# EAGLE design radiofmtx (EAGLE 4.16)
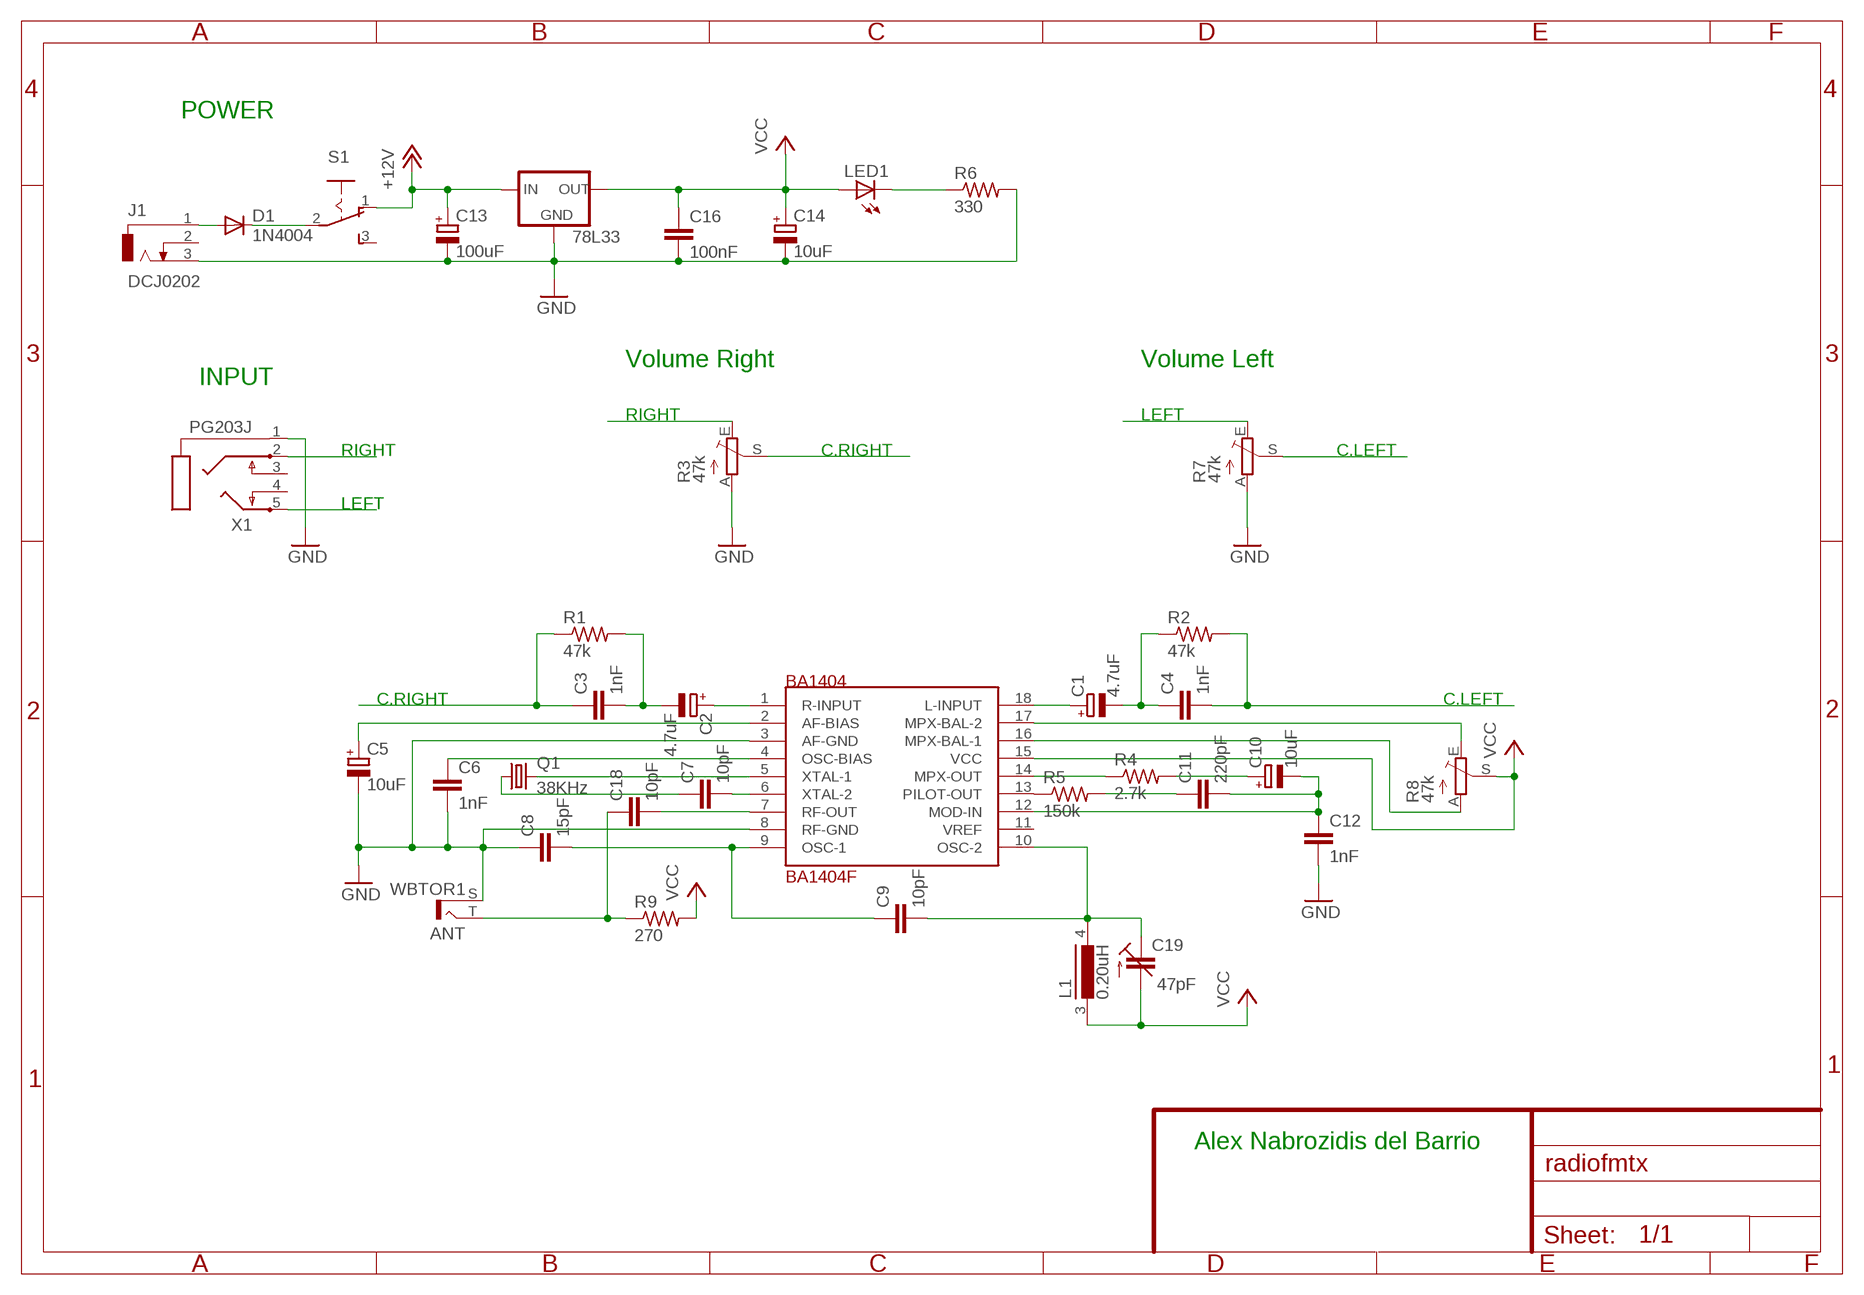
[diagram p0: schematic, sheet 1]

## Parts
78L33  78XXS  [78XXS]
ANT  WBTOR1  [WBTOR1]
BA1404  BA1404F  [BA1404F]
C1  4.7uF  CPOL-EUTAP5-50  [TAP5-50]
C2  4.7uF  CPOL-EUTAP5-50  [TAP5-50]
C3  1nF  C-EU050-025X075  [C050-025X075]
C4  1nF  C-EU050-025X075  [C050-025X075]
C5  10uF  CPOL-EUTAP5-50  [TAP5-50]
C6  1nF  C-EU050-025X075  [C050-025X075]
C7  10pF  C-EU050-024X044  [C050-024X044]
C8  15pF  C-EU050-024X044  [C050-024X044]
C9  10pF  C-EU050-024X044  [C050-024X044]
C10  10uF  CPOL-EUTAP5-50  [TAP5-50]
C11  220pF  C-EU050-024X044  [C050-024X044]
C12  1nF  C-EU050-025X075  [C050-025X075]
C13  100uF  CPOL-EUTAP5-50  [TAP5-50]
C14  10uF  CPOL-EUTAP5-45  [TAP5-45]
C16  100nF  C-EU050-025X075  [C050-025X075]
C18  10pF  C-EU050-024X044  [C050-024X044]
C19  47pF  C-TRIMM808  [CTRIM808-BC]
D1  1N4004  [DO41-10]
J1  DCJ0202  [DCJ0202]
L1  0.20uH  SK11  [SK11]
LED1  LED5MM  [LED5MM]
Q1  38KHz  CRYSTALTC26V  [TC26V]
R1  47k  R-US_0207/7  [0207/7]
R2  47k  R-US_0207/7  [0207/7]
R3  47k  TRIM_EU-S63S  [S63S]
R4  2.7k  R-US_0207/7  [0207/7]
R5  150k  R-US_0207/7  [0207/7]
R6  330  R-US_0207/7  [0207/7]
R7  47k  TRIM_EU-S63S  [S63S]
R8  47k  TRIM_EU-S63S  [S63S]
R9  270  R-US_0207/7  [0207/7]
S1  255SB  [255SB]
X1  PG203J  [PG203J]

## Nets
+12V: 78L33.IN C13.+ S1.1(O)
C.LEFT: C4.2 R2.2 R7.S
C.RIGHT: C3.1 R1.1 R3.S
GND: 78L33.GND ANT.S BA1404.3(AF-GND) BA1404.8(RF-GND) C5.- C6.2 C8.1 C12.2 C13.- C14.- C16.2 J1.3 R3.A R6.2 R7.A X1.1
LEFT: R7.E X1.5
N$1: BA1404.1(R-INPUT) C2.+
N$2: BA1404.18(L-INPUT) C1.+
N$3: C2.- C3.2 R1.2
N$4: C1.- C4.1 R2.1
N$5: BA1404.2(AF-BIAS) C5.+
N$6: C7.1 Q1.1
N$7: BA1404.4(OSC-BIAS) C6.1
N$8: BA1404.5(XTAL-1) Q1.2
N$9: BA1404.6(XTAL-2) C7.2
N$10: BA1404.9(OSC-1) C8.2 C9.1
N$11: BA1404.10(OSC-2) C9.2 C19.1(E) L1.4
N$12: BA1404.17(MPX-BAL-2) R8.E
N$13: BA1404.16(MPX-BAL-1) R8.A
N$14: BA1404.12(MOD-IN) C10.- C11.2 C12.1
N$15: LED1.K(C) R6.1
N$16: BA1404.14(MPX-OUT) R4.1
N$17: BA1404.13(PILOT-OUT) R5.1
N$18: C10.+ R4.2
N$19: C11.1 R5.2
N$22: D1.A J1.1
N$23: BA1404.7(RF-OUT) C18.2
N$24: ANT.T C18.1 R9.1
N$25: D1.C S1.2(P)
RIGHT: R3.E X1.2
VCC: 78L33.OUT BA1404.15(VCC) C14.+ C16.1 C19.2(A) L1.3 LED1.A R8.S R9.2
Unconnected: BA1404.11(VREF) J1.2 S1.3(S) X1.3 X1.4

## Notes on the sheet
- POWER
- Volume Right | Volume Left
- INPUT
- RIGHT | LEFT
- RIGHT | C.RIGHT | C.LEFT
- LEFT
- C.RIGHT | C.LEFT
- Alex Nabrozidis del Barrio

## Library data of the parts
78L33 = v-reg:78XXS: VOLTAGE REGULATOR
ANT = rca:WBTOR1: RCA connectors according to JEITA RC-5231 Cinch RCA-Einbaukupplung nach JEITA RC-5231, abgewinkelte Ausführung Source: http://www.lumberg.de/Produkte/PDFs/WBTOR1.pdf
BA1404 = ba1404:BA1404: BA1404 FM STEREO TRANSMITTER Based on the english datasheet.
C1 C2 C5 C10 C13 C14 = rcl:CPOL-EU: POLARIZED CAPACITOR, European symbol
C3 C4 C6-C9 C11 C12 C16 C18 = rcl:C-EU: CAPACITOR, European symbol
C19 = rcl:C-TRIMM: Trimm capacitor
D1 = diode:1N4004: DIODE general purpose rectifier, 1 A
J1 = con-jack:DCJ0202: DC POWER JACK Source: DCJ0202.pdf
L1 = variable_inductors:SK11: INDUCTOR
LED1 = led:LED: LED OSRAM: - CHIPLED LG R971, LG N971, LY N971, LG Q971, LY Q971, LO R971, LY R971 LH N974, LH R974 LS Q976, LO Q976, LY Q976 LO Q996 - Hyper CHIPLED LW Q18S LB Q993, LB Q99A, LB R99A - SideLED LS A670, LO A670, LY A670, LG A670, LP A670 LB A673, LV A673, LT A673, LW A673 LH A674 LY A675 LS A676, LA A676, LO A676, LY A676, LW A676 LS A679, LY A679, LG A679 - Hyper Micro SIDELED® LS Y876, LA Y876, LO Y876, LY Y876 LT Y87S - SmartLED LW L88C, LW L88S LB L89C, LB L89S, LG L890 LS L89K, LO L89K, LY L89K LS L896, LA L896, LO L896, LY L896 - TOPLED LS T670, LO T670, LY T670, LG T670, LP T670 LSG T670, LSP T670, LSY T670, LOP T670, LYG T670 LG T671, LOG T671, LSG T671 LB T673, LV T673, LT T673, LW T673 LH T674 LS T676, LA T676, LO T676, LY T676, LB T676, LH T676, LSB T676, LW T676 LB T67C, LV T67C, LT T67C, LS T67K, LO T67K, LY T67K, LW E67C LS E67B, LA E67B, LO E67B, LY E67B, LB E67C, LV E67C, LT E67C LW T67C LS T679, LY T679, LG T679 LS T770, LO T770, LY T770, LG T770, LP T770 LB T773, LV T773, LT T773, LW T773 LH T774 LS E675, LA E675, LY E675, LS T675 LS T776, LA T776, LO T776, LY T776, LB T776 LHGB T686 LT T68C, LB T68C - Hyper Mini TOPLED® LB M676 - Mini TOPLED Santana® LG M470 LS M47K, LO M47K, LY M47K Source: http://www.osram.convergy.de - LUMILED® LXK2-PW12-R00, LXK2-PW12-S00, LXK2-PW14-U00, LXK2-PW14-V00 LXK2-PM12-R00, LXK2-PM12-S00, LXK2-PM14-U00 LXK2-PE12-Q00, LXK2-PE12-R00, LXK2-PE12-S00, LXK2-PE14-T00, LXK2-PE14-U00 LXK2-PB12-K00, LXK2-PB12-L00, LXK2-PB12-M00, LXK2-PB14-N00, LXK2-PB14-P00, LXK2-PB14-Q00 LXK2-PR12-L00, LXK2-PR12-M00, LXK2-PR14-Q00, LXK2-PR14-R00 LXK2-PD12-Q00, LXK2-PD12-R00, LXK2-PD12-S00 LXK2-PH12-R00, LXK2-PH12-S00 LXK2-PL12-P00, LXK2-PL12-Q00, LXK2-PL12-R00 Source: www.luxeon.com
Q1 = crystal:CRYSTAL: CRYSTAL
R1 R2 R4-R6 R9 = rcl:R-US_: RESISTOR, American symbol
R3 R7 R8 = potenciometers:TRIM_EU-: POTENTIOMETER
S1 = switch:255SB: SLIDING SWITCH distributor Buerklin, 11G810
X1 = con-hirschmann:PG203J: MIC/HEADPHONE JACK KS-S stereo microphone/headphone jack PG203JN (Schukat)

## Board
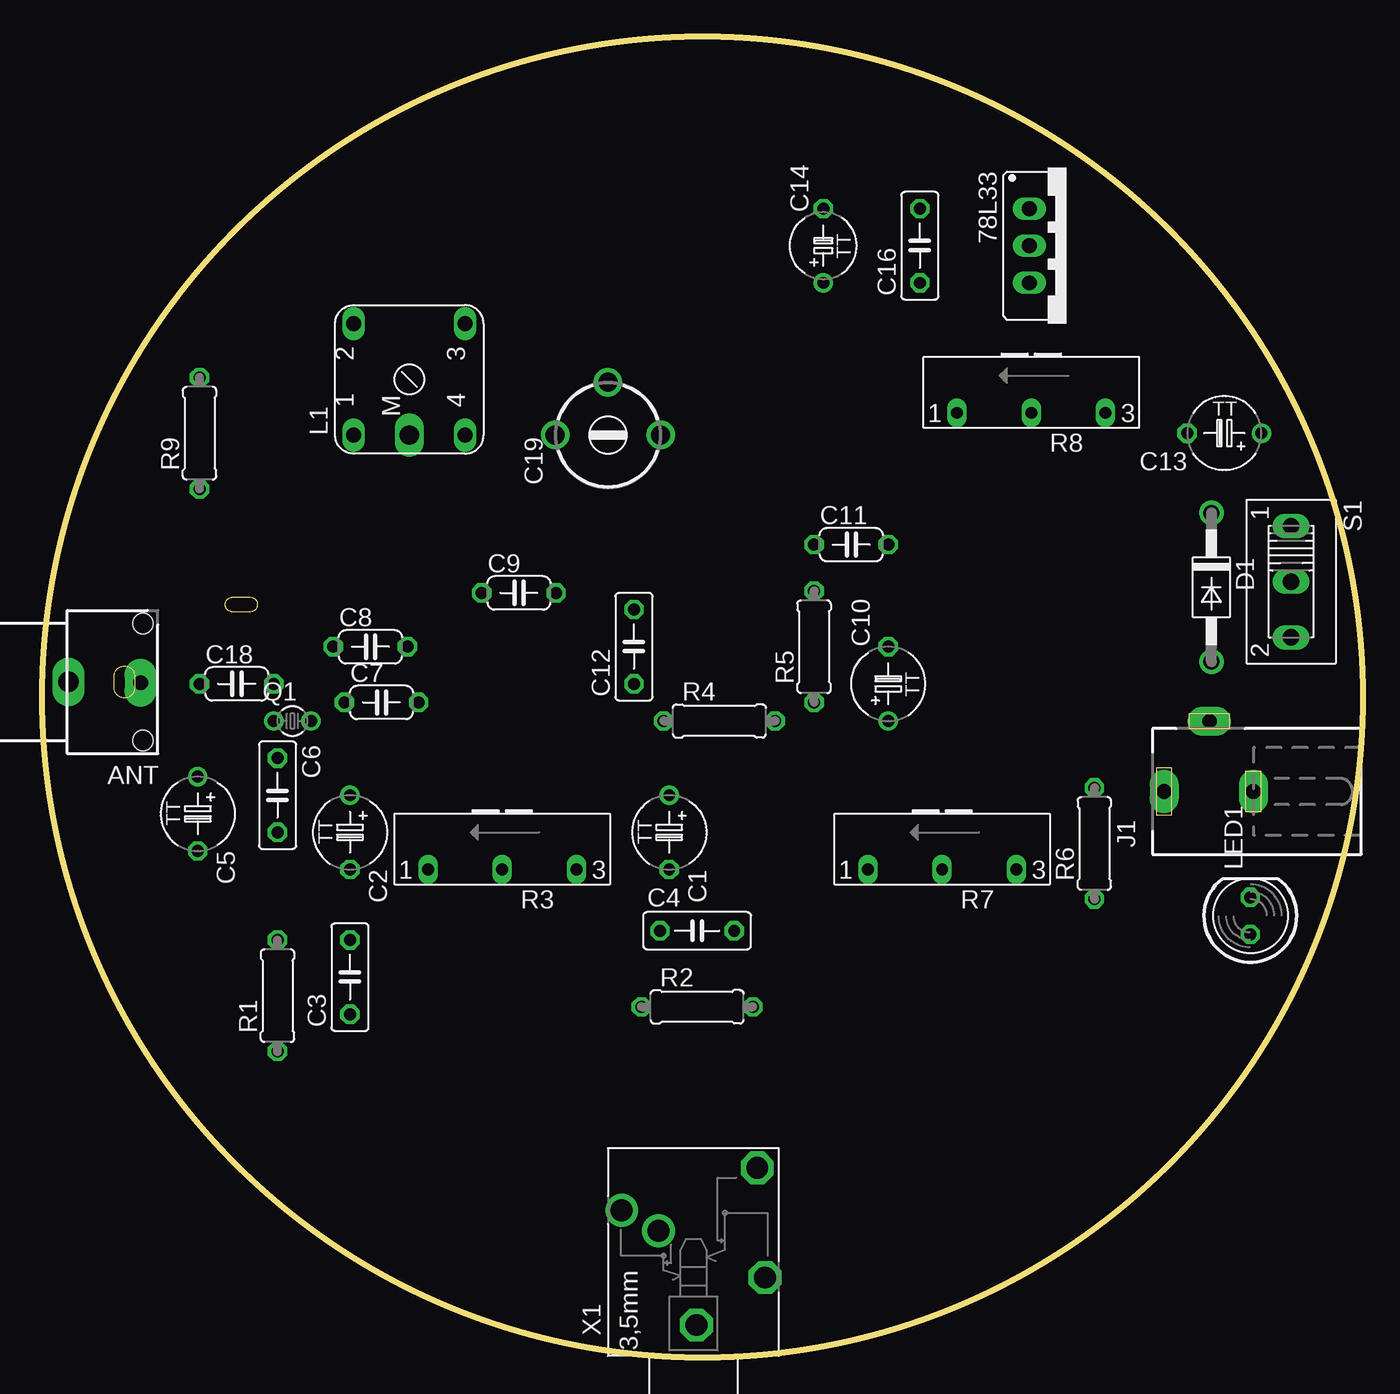
[diagram p1: board, top side]
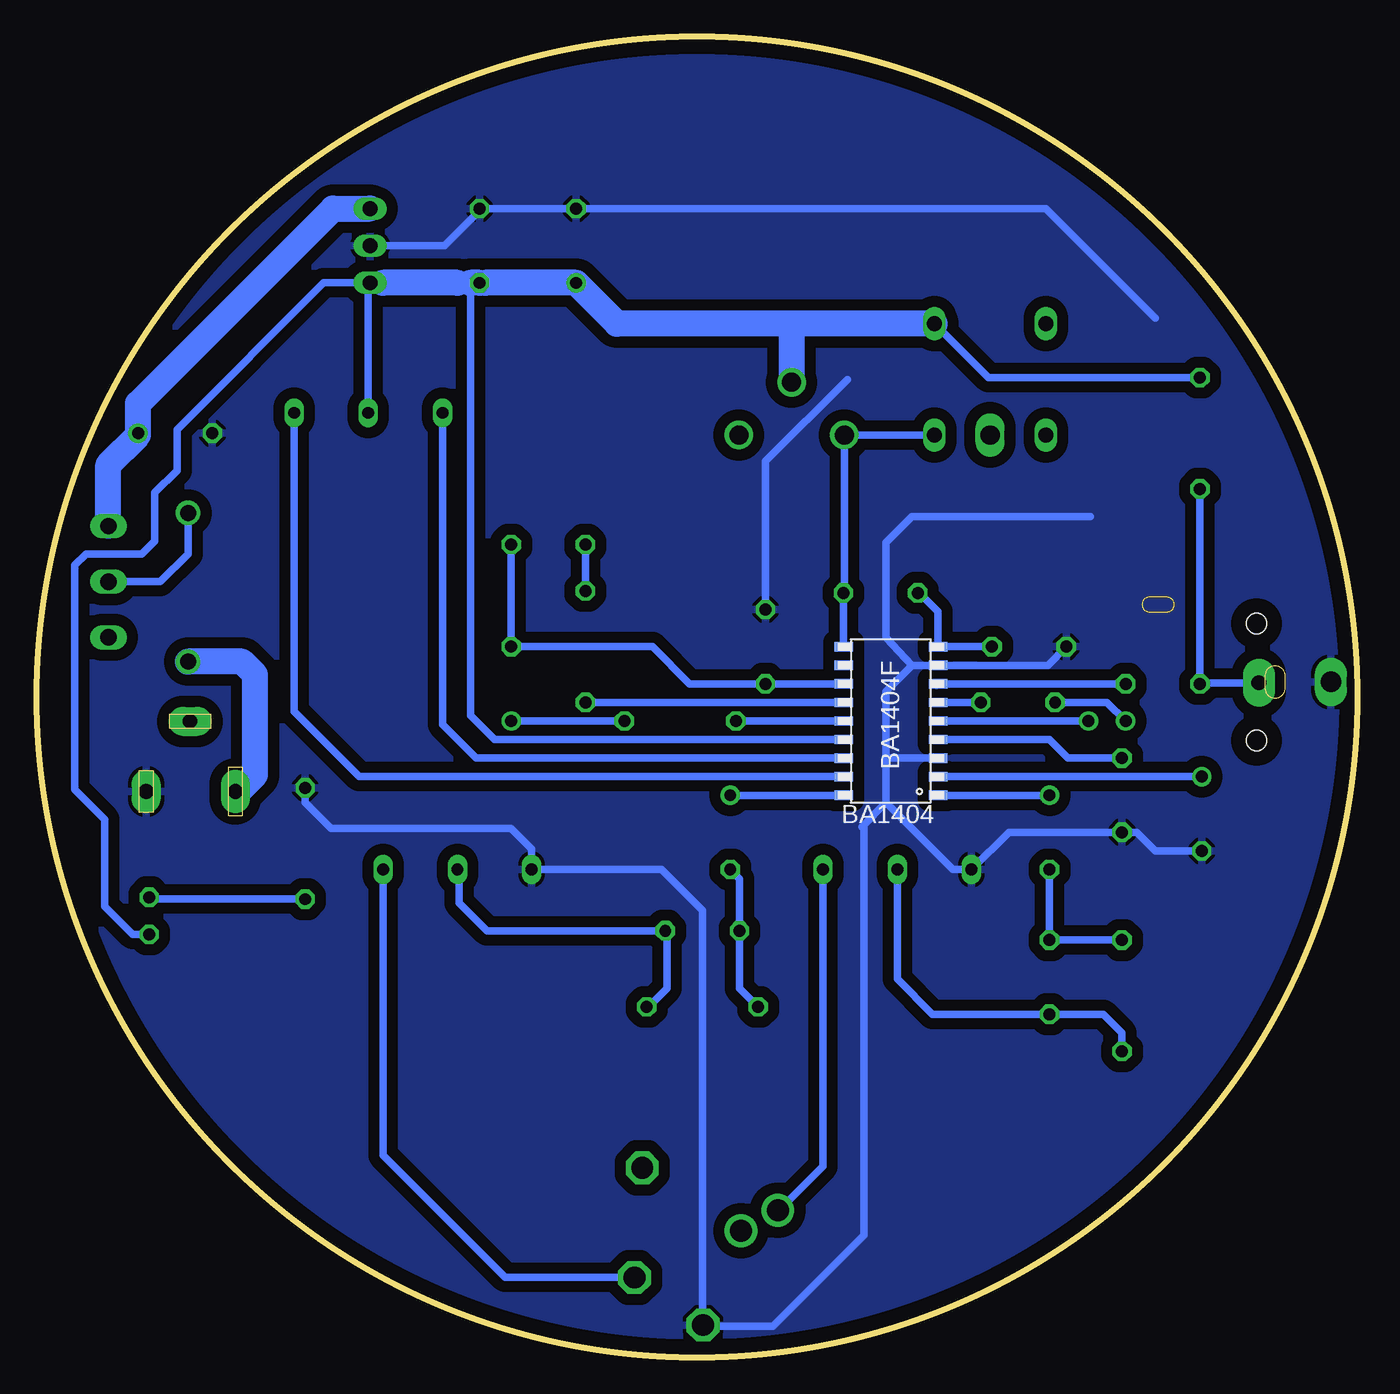
[diagram p2: board, bottom side, seen from below]

Size 90.34 x 90.34 mm. Coordinates in mm from the lower left corner, seen from the top.
Outline: circle at 45.17,45.17 radius 45.17
Copper layers (1*16): Top 0.035mm / dielectric 1.5mm / Bottom 0.035mm
Design rules "default": minimum track width 20mil, minimum drill 20mil, track to track 30mil, track to pad 30mil, pad to pad 30mil, via to via 30mil, smd to smd 8mil, copper to edge 40mil, drill to drill 8mil, minimum pad ring 10mil, minimum via ring 8mil, stop-mask expansion 4mil, vias tented up to drill 0mil, thermal gap 10mil

### Footprints (pad centres in the part's own frame; a part is rotated, then mirrored left to right if it is on the bottom)
78XXS = drill 1.016 long: GND 0,-2.54; IN -2.54,-2.54; OUT 2.54,-2.54
WBTOR1 = drill 1.4 pad 2.2 long: S 0,-0.19 | drill 1 pad 2.2 long: T -0.065,-5.114 | hole 1.4: -4.004,-5.27; 4.004,-5.27
BA1404F = smd 0.635 x 1.27: 1 -4.953,-3.302; 2 -3.683,-3.302; 3 -2.413,-3.302; 4 -1.143,-3.302; 5 0.127,-3.302; 6 1.397,-3.302; 7 2.667,-3.302; 8 3.937,-3.302; 9 5.207,-3.302; 10 5.207,3.175; 11 3.937,3.175; 12 2.667,3.175; 13 1.397,3.175; 14 0.127,3.175; 15 -1.143,3.175; 16 -2.413,3.175; 17 -3.683,3.175; 18 -4.953,3.175
TAP5-50 = drill 0.813 round: + -2.54,0 | drill 0.813 octagon: - 2.54,0
C050-025X075 = drill 0.813 octagon: 1 -2.54,0; 2 2.54,0
C050-024X044 = drill 0.813 octagon: 1 -2.54,0; 2 2.54,0
TAP5-45 = drill 0.813 round: + -2.54,0 | drill 0.813 octagon: - 2.54,0
CTRIM808-BC = drill 1.3 round: 1 -3.607,0; 2 0,3.607; 3 3.607,0
DO41-10 = drill 1.118 round: A 5.08,0; C -5.08,0
DCJ0202 = drill 1 pad 2 long: 1 0,3.1; 2 4.8,0; 3 0,-3
SK11 = drill 1.016 long: 1 -5.08,2.54; 2 2.54,2.54; 3 2.54,-5.08; 4 -5.08,-5.08 | drill 1.321 long: M -5.08,-1.27
LED5MM = drill 0.813 octagon: A -1.27,0; K 1.27,0
TC26V = drill 0.813 round: 1 -1.27,0; 2 1.27,0
0207/7 = drill 0.813 octagon: 1 -3.81,0; 2 3.81,0
S63S = drill 0.813 long: A 5.08,1.27; E -5.08,1.27; S 0,1.27
255SB = drill 1.118 long: 1 -3.81,0; 2 0,0; 3 3.81,0
PG203J = drill 1.499 octagon: 1 -5.004,-0.203; 4 5.74,-4.369; 5 -1.753,-4.902 | drill 1.499 round: 2 2.845,4.902; 3 1.448,2.388

### Placement (x,y rotation side)
78L33  70.06,76.03 270 top
ANT  1.61,46.19 90 top
BA1404  31.96,43.39 90 bottom
C1  42.89,35.9 270 top
C2  21.04,35.9 270 top
C3  21.04,25.99 90 top
C4  44.79,29.17 0 top
C5  10.63,37.17 270 top
C6  16.09,38.44 270 top
C7  23.2,44.79 0 top
C8  22.44,48.6 0 top
C9  32.6,52.28 0 top
C10  57.87,46.06 90 top
C11  55.33,55.59 0 top
C12  40.47,48.6 90 top
C13  80.86,63.21 180 top
C14  53.43,76.03 90 top
C16  60.03,76.03 90 top
C18  13.29,46.06 0 top
C19  38.69,63.08 0 top
D1  79.97,52.66 270 top
J1  79.84,38.69 90 top
L1  23.84,68.16 90 top
LED1  82.64,30.19 90 top
Q1  17.1,43.52 0 top
R1  16.09,24.72 90 top
R2  44.79,23.96 0 top
R3  31.46,34.63 180 top
R4  46.31,43.52 0 top
R5  52.79,48.6 90 top
R6  71.97,35.14 90 top
R7  61.55,34.63 180 top
R8  67.65,65.87 180 top
R9  10.75,63.21 90 top
S1  85.43,53.05 270 top
X1  44.54,7.2 90 top

### Tracks (layer width: path | path; a pad name or v marks a point on that pad's centre or on a via)
+12V
  Bottom 1.778: 78L33.IN 70.06,78.57 83.4,65.24 C13.+ 83.4,63.08 85.43,61.05 S1.1
C.LEFT
  Bottom 0.508: C4.2 47.2,29.17 | R2.2 48.47,23.96 47.2,25.23 47.2,29.3 C4.2 | C4.2 59.52,29.17 61.43,31.07 61.43,33.23 R7.S
C.RIGHT
  Bottom 0.508: R3.S 31.46,25.87 29.04,23.45 C3.1 17.36,23.45 16.09,22.18 16.09,21.04 15.96,20.91 R1.1
GND
  Bottom 0.508: C8.1 21.17,47.33 BA1404.8 30.44,47.33 | 59.9,78.57 C16.2 | 78L33.GND 62.44,76.03 59.9,78.57 | C14.- 59.9,78.57 | C14.- 53.3,78.7 | 30.44,47.33 32.22,49.24 32.22,55.71 30.44,57.49 18.25,57.49 | 13.8,71.08 21.3,78.57 C14.- | C13.- 78.32,63.08 | 33.74,36.28 33.74,8.34 39.96,2.12 44.54,2.12 44.66,1.99 44.74,2.07 X1.1 44.74,2.17 44.79,2.12 44.79,30.57 47.58,33.36 R7.A 56.47,34.76 57.87,36.15 70.19,36.15 71.97,37.93 R6.2 | 33.74,36.28 33.74,36.41 | 32.22,40.73 32.22,40.6 | 32.22,40.73 32.22,40.98 | 32.22,40.98 32.22,45.55 30.44,47.33 | 33.74,36.28 33.87,36.28 32.22,37.93 | 32.22,37.93 32.22,40.73 | 32.22,37.93 27.65,33.36 R3.A 23.84,35.9 C6.2 15.07,35.9 13.8,34.63 10.75,34.63 10.63,34.76 C5.- | 32.22,40.98 BA1404.3 | C12.2 40.47,61.3 34.88,66.89
  pour Bottom: -23.66,102.83 77.94,102.83 116.04,64.73 116.04,26.63 77.94,-11.47 14.44,-11.47 -23.66,26.63
LEFT
  Bottom 0.508: X1.5 58.28,5.45 66.63,13.8 R7.E 66.63,33.49
N$1
  Bottom 0.508: C2.+ BA1404.1
N$2
  Bottom 0.508: BA1404.18 C1.+
N$3
  Bottom 0.508: R1.2 C3.2 C2.-
N$4
  Bottom 0.508: C1.- 42.25,32.73 42.25,29.3 | 42.25,29.3 C4.1 | R2.1 42.25,25.23 42.25,29.3
N$5
  Bottom 0.508: C5.+ BA1404.2
N$6
  Bottom 0.508: C7.1 17.1,44.79 Q1.1
N$7
  Bottom 0.508: C6.1 19.77,40.98 21.04,42.25 BA1404.4
N$8
  Bottom 0.508: 28.79,43.52 BA1404.5 Q1.2
N$9
  Bottom 0.508: 25.61,44.79 C7.2 BA1404.6
N$10
  Bottom 0.508: C9.1 29.93,52.28 28.66,51.01 BA1404.9 C8.2
N$11
  Bottom 0.508: BA1404.10 C9.2 35.09,52.33 C19.1 L1.4 28.79,63.08
N$12
  Bottom 0.508: BA1404.17 68.29,39.71 72.73,44.16 72.73,64.48 72.86,64.6 R8.E
N$13
  Bottom 0.508: R8.A 62.57,43.27 60.28,40.98 BA1404.16
N$14
  Bottom 0.508: BA1404.12 C12.1 40.47,45.93 40.6,46.06 45.68,46.06 48.22,48.6 57.74,48.6 | 57.74,48.6 C10.- | C11.2 57.87,48.73 57.74,48.6
N$15
  Bottom 0.508: LED1.K 82.76,31.46 82.64,31.33 R6.1
N$16
  Bottom 0.508: BA1404.14 R4.1
N$17
  Bottom 0.508: BA1404.13 R5.1
N$18
  Bottom 0.508: R4.2 C10.+
N$19
  Bottom 0.508: R5.2 52.66,52.54 52.79,52.66 C11.1
N$22
  Bottom 1.778: J1.1 76.74,38.64 76.67,38.57 75.4,39.84 75.4,46.7 76.29,47.58 D1.A
N$23
  Bottom 0.508: 28.79,46.06 BA1404.7 | C18.2 28.79,46.06 | 28.79,46.06 28.79,45.93
N$24
  Bottom 0.508: 10.75,46.12 C18.1 | ANT.T 10.75,46.12 | 10.75,46.12 10.75,46.19 | C18.1 10.75,45.93 | C18.1 R9.1
N$25
  Bottom 0.508: D1.C 79.97,54.95 81.87,53.05 S1.2
RIGHT
  Bottom 0.508: X1.2 39.58,9.99 36.54,13.04 R3.E
VCC
  Bottom 0.508: 61.55,73.49 60.67,73.49 60.67,43.9 59.01,42.25 BA1404.15 | 78L33.OUT 66.63,73.49 66.76,73.49 | C16.1 59.65,73.49 59.78,73.49 | 67.52,64.6 R8.S 67.65,73.49 | 78L33.OUT 67.65,73.62 67.65,73.49 | 78L33.OUT 67.65,73.49 | 82.51,28.92 LED1.A 83.78,28.92 85.68,30.82 85.68,36.79 87.72,38.82 87.72,54.19 86.95,54.95 83.14,54.95 82.26,55.84 82.26,59.14 80.73,60.67 80.73,63.46 70.7,73.49 67.65,73.49 | L1.3 25.23,67.02 R9.2 | R9.2 10.75,67.14 | R9.2 10.63,67.02
  Bottom 1.778: C16.1 60.67,73.49 | 61.55,73.49 66.63,73.49 | 59.65,73.49 C14.+ 50.63,70.7 38.69,70.7 | L1.3 38.69,70.7 | 38.69,70.7 C19.2